# Altium schematic sheet Connectors.SchDoc
size A
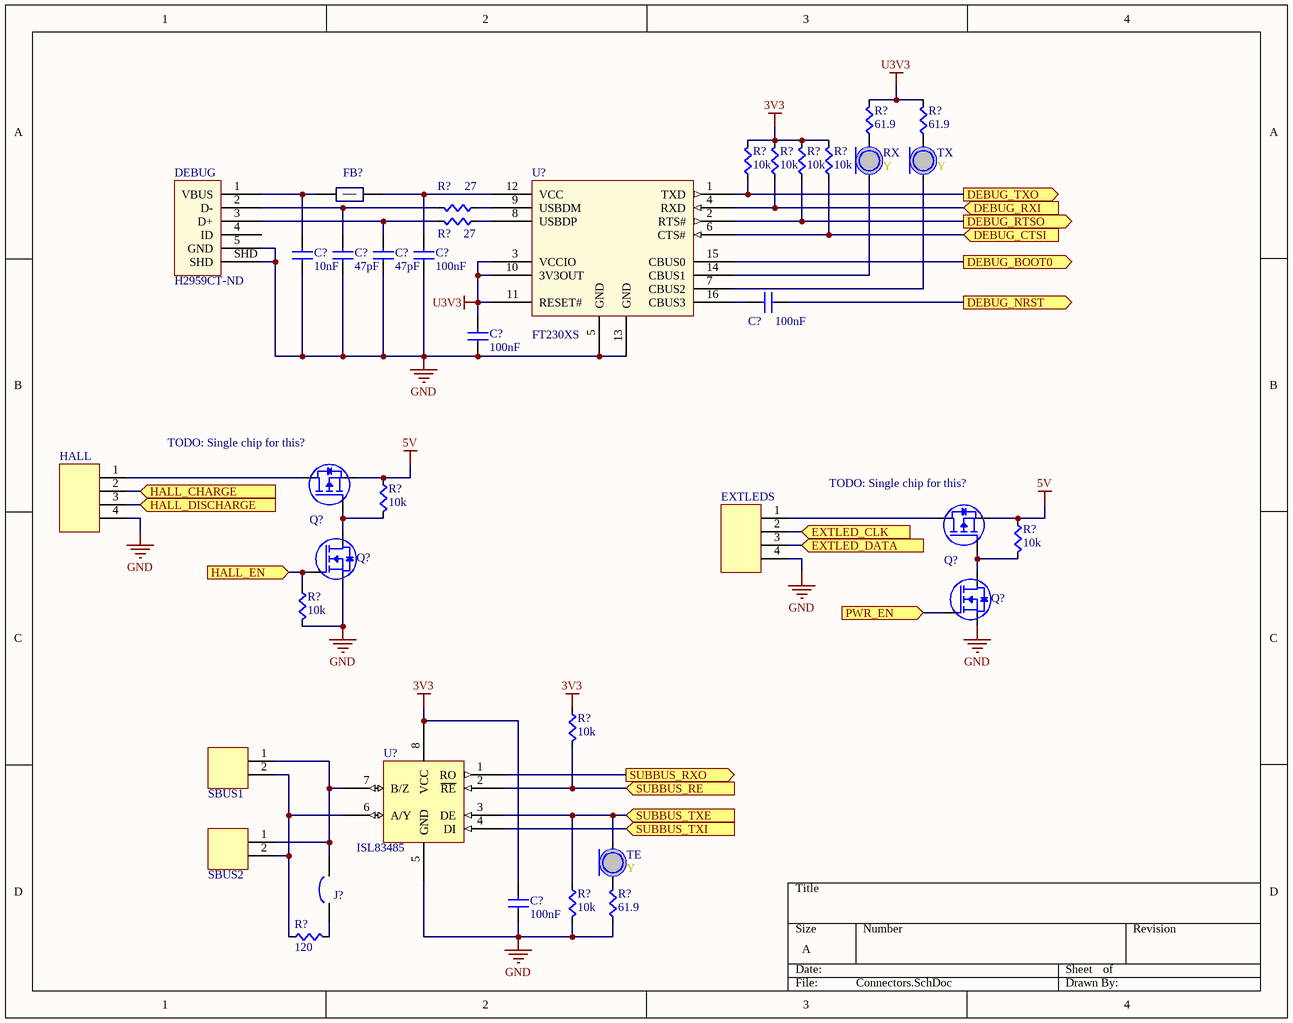
[diagram p0: Connectors.SchDoc]

## Parts
(Parts that share a designator on the sheet are numbered #1, #2 ... from top to bottom, then left to right.)
C?#1  value 10nF  [CAPC0603]  (hidden comment: Cap)
C?#2  value 47pF  [CAPC0603]  (hidden comment: Cap)
C?#3  value 47pF  [CAPC0603]  (hidden comment: Cap)
C?#4  value 100nF  [CAPC0603]  (hidden comment: Cap)
C?#5  value 100nF  [CAPC0603]  (hidden comment: Cap)
C?#6  value 100nF  [CAPC0603]  (hidden comment: Cap)
C?#7  value 100nF  [CAPC0603]  (hidden comment: Cap)
DEBUG  Supplier Part Number 1: H2959CT-ND  [UX60-MB-5ST]  (hidden comment: UX60-MB-5ST)
EXTLEDS  MOLEX-HDR-1x4-SHERLOCK_RA  [MOLEX-HDR-1X4-SHERLOCK-RA]  (value not drawn)
FB?  FBead  [RES0603]  (value not drawn)
HALL  MOLEX-HDR-1x4-SHERLOCK_RA  [MOLEX-HDR-1X4-SHERLOCK-RA]  (value not drawn)
J?  Jumper  [HEADER_MALE_1X2]  (value not drawn)
Q?#1  FDN5618P  [PowerSOT-3]  (value not drawn)
Q?#2  FDN5618P  [PowerSOT-3]  (value not drawn)
Q?#3  FDN5630  [PowerSOT-3]  (value not drawn)
Q?#4  FDN5630  [PowerSOT-3]  (value not drawn)
R?#1  value 61.9  [RES0603]  (hidden comment: Res)
R?#2  value 61.9  [RES0603]  (hidden comment: Res)
R?#3  value 10k  [RES0603]  (hidden comment: Res)
R?#4  value 10k  [RES0603]  (hidden comment: Res)
R?#5  value 10k  [RES0603]  (hidden comment: Res)
R?#6  value 10k  [RES0603]  (hidden comment: Res)
R?#7  value 27  [RES0603]  (hidden comment: Res)
R?#8  value 27  [RES0603]  (hidden comment: Res)
R?#9  value 10k  [RES0603]  (hidden comment: Res)
R?#10  value 10k  [RES0603]  (hidden comment: Res)
R?#11  value 10k  [RES0603]  (hidden comment: Res)
R?#12  value 10k  [RES0603]  (hidden comment: Res)
R?#13  value 10k  [RES0603]  (hidden comment: Res)
R?#14  value 61.9  [RES0603]  (hidden comment: Res)
R?#15  value 120  [RES0603]  (hidden comment: Res)
RX  Color: Y  [LED0603]  (hidden comment: LED)
SBUS1  2-pin Horz Sherlock  [MOLEX-HDR-1X2-SHERLOCK-HORZ]  (value not drawn)
SBUS2  2-pin Horz Sherlock  [MOLEX-HDR-1X2-SHERLOCK-HORZ]  (value not drawn)
TE  Color: Y  [LED0603]  (hidden comment: LED)
TX  Color: Y  [LED0603]  (hidden comment: LED)
U?#1  FT230XS  [FT230XS]
U?#2  ISL83485  [ISL8348xIBZ]

## Ports
DEBUG_BOOT0 (out), DEBUG_CTSI (in), DEBUG_NRST (out), DEBUG_RTSO (out), DEBUG_RXI (in), DEBUG_TXO (out), EXTLED_CLK (in), EXTLED_DATA (in), HALL_CHARGE (in), HALL_DISCHARGE (in), HALL_EN (in), PWR_EN (in), SUBBUS_RE (in), SUBBUS_RXO (out), SUBBUS_TXE (in), SUBBUS_TXI (in)

## Nets
3V3: C?#7.1(A) R?#3.1(A) R?#4.1(A) R?#5.1(A) R?#6.1(A) R?#12.1(A) U?#2.8(VCC)
5V: Q?#1.2(S) Q?#2.2(S) R?#9.1(A) R?#10.1(A)
GND: C?#1.2(B) C?#2.2(B) C?#3.2(B) C?#4.2(B) C?#6.2(B) C?#7.2(B) DEBUG.5(GND) DEBUG.SHD EXTLEDS.4 HALL.4 Q?#3.S Q?#4.S R?#11.2(B) R?#13.2(B) R?#14.2(B) U?#1.5(GND) U?#1.13(GND) U?#2.5(GND)
U3V3: C?#6.1(A) R?#1.1(A) R?#2.1(A) U?#1.3(VCCIO) U?#1.10(3V3OUT) U?#1.11(RESET#)
DEBUG_BOOT0: U?#1.15(CBUS0) ; port DEBUG_BOOT0
DEBUG_CTSI: R?#6.2(B) U?#1.6(CTS#) ; port DEBUG_CTSI
DEBUG_NRST: C?#5.2(B) ; port DEBUG_NRST
DEBUG_RTSO: R?#5.2(B) U?#1.2(RTS#) ; port DEBUG_RTSO
DEBUG_RXI: R?#4.2(B) U?#1.4(RXD) ; port DEBUG_RXI
DEBUG_TXO: R?#3.2(B) U?#1.1(TXD) ; port DEBUG_TXO
EXTLED_CLK: EXTLEDS.2 ; port EXTLED_CLK
EXTLED_DATA: EXTLEDS.3 ; port EXTLED_DATA
HALL_CHARGE: HALL.2 ; port HALL_CHARGE
HALL_DISCHARGE: HALL.3 ; port HALL_DISCHARGE
HALL_EN: Q?#3.G R?#11.1(A) ; port HALL_EN
PWR_EN: Q?#4.G ; port PWR_EN
SUBBUS_RE: R?#12.2(B) U?#2.2(~{RE}) ; port SUBBUS_RE
SUBBUS_RXO: U?#2.1(RO) ; port SUBBUS_RXO
SUBBUS_TXE: R?#13.1(A) TE.A U?#2.3(DE) ; port SUBBUS_TXE
SUBBUS_TXI: U?#2.4(DI) ; port SUBBUS_TXI
NetC?#1_1: C?#1.1(A) DEBUG.1(VBUS) FB?.2(B)
NetC?#2_1: C?#2.1(A) DEBUG.2(D-) R?#7.1(A)
NetC?#3_1: C?#3.1(A) DEBUG.3(D+) R?#8.1(A)
NetC?#4_1: C?#4.1(A) FB?.1(A) U?#1.12(VCC)
NetC?#5_1: C?#5.1(A) U?#1.16(CBUS3)
NetEXTLEDS_1: EXTLEDS.1 Q?#2.3(D)
NetHALL_1: HALL.1 Q?#1.3(D)
NetJ?_1: J?.1 R?#15.1(A)
NetJ?_2: J?.2 SBUS1.1 SBUS2.1 U?#2.7(B/Z)
NetQ?#1_1: Q?#1.1(G) Q?#3.D R?#9.2(B)
NetQ?#2_1: Q?#2.1(G) Q?#4.D R?#10.2(B)
NetR?#1_2: R?#1.2(B) RX.A
NetR?#2_2: R?#2.2(B) TX.A
NetR?#7_2: R?#7.2(B) U?#1.9(USBDM)
NetR?#8_2: R?#8.2(B) U?#1.8(USBDP)
NetR?#14_1: R?#14.1(A) TE.C
NetR?#15_2: R?#15.2(B) SBUS1.2 SBUS2.2 U?#2.6(A/Y)
NetRX_C: RX.C U?#1.14(CBUS1)
NetTX_C: TX.C U?#1.7(CBUS2)

Not connected (* = marked no-connect by the designer): DEBUG 4(ID)

## Notes on the sheet
- (near Q?#1) TODO: Single chip for this?
- TODO: Single chip for this?

## Library data of the parts
DEBUG = UX60-MB-5ST: USB Mini B Metal Shield SMT Type With Positioning Post; Supplier 1: Digi-Key
EXTLEDS HALL = MOLEX-HDR-1x4-SHERLOCK_RA: Header, Molex, 2mm Pitch Sherlock Header, Single Row, Horizontal, 4 Circuits, Length 3.3mm; Manufacturer Part Number: 0353630460; Supplier Part Number: WM18933-ND; Manufacturer: Molex; Supplier: Digikey
FB? = FBead: Ferrite Bead; Supplier 1: Digi-Key; Supplier Part Number 1: 445-2988-1-ND
J? = Jumper: Single Jumper on 1x2 Male Header
Q?#1 Q?#2 = FDN5618P: 60V P-Channel Logic Level PowerTrench MOSFET; Supplier 1: Digi-Key; Supplier Part Number 1: FDN5618PCT-ND
Q?#3 Q?#4 = FDN5630: 60V N-Channel PowerTrench MOSFET; Supplier 1: Digi-Key; Supplier Part Number 1: FDN5630CT-ND
SBUS1 SBUS2 = MOLEX-HDR-1x2-SHERLOCK_RA: Header, Molex, 2mm Pitch Sherlock Header, Single Row, Horizontal, 2 Circuits, Length 3.3mm,  0353630260; Manufacturer: Molex Inc; Manufacturer Part Number: 0353630260; Supplier Part Number: WM18931-ND; Supplier: Digi-Key
U?#1 = FT230XS: USB To Basic UART IC; Supplier 1: Digi-Key; Supplier Part Number 1: 768-1154-5-ND
U?#2 = ISL83485: 3.3V RS485 Transceiver; Manufacturer: Intersil; Manufacturer PN: ISL83485IBZ; Distributor: Digikey; Distributor PN: ISL83485IBZ-ND; Supplier 1: Digi-Key; Supplier Part Number 1: ISL83485IBZ-ND
C?#1-C?#7 = Cap: Supplier 1: Digi-Key
  C?#1: Supplier Part Number 1: 445-1311-1-ND
  C?#2 C?#3: Supplier Part Number 1: 445-1277-1-ND
  C?#4-C?#7: Supplier Part Number 1: 399-1095-1-ND
R?#1-R?#15 = Res: Supplier 1: Digi-Key
  R?#1 R?#2 R?#14: Supplier Part Number 1: RMCF0603FT61R9
  R?#3-R?#6 R?#9-R?#13: Supplier Part Number 1: RMCF0603JT10K0CT-ND
  R?#7 R?#8: Supplier Part Number 1: RMCF0603JT27R0CT-ND
  R?#15: Supplier Part Number 1: RHM120HCT-ND
RX TE TX = LED: Supplier 1: Digi-Key; Supplier Part Number 1: 754-1125-1-ND